# Altium schematic sheet TCA9548A.SchDoc
size B
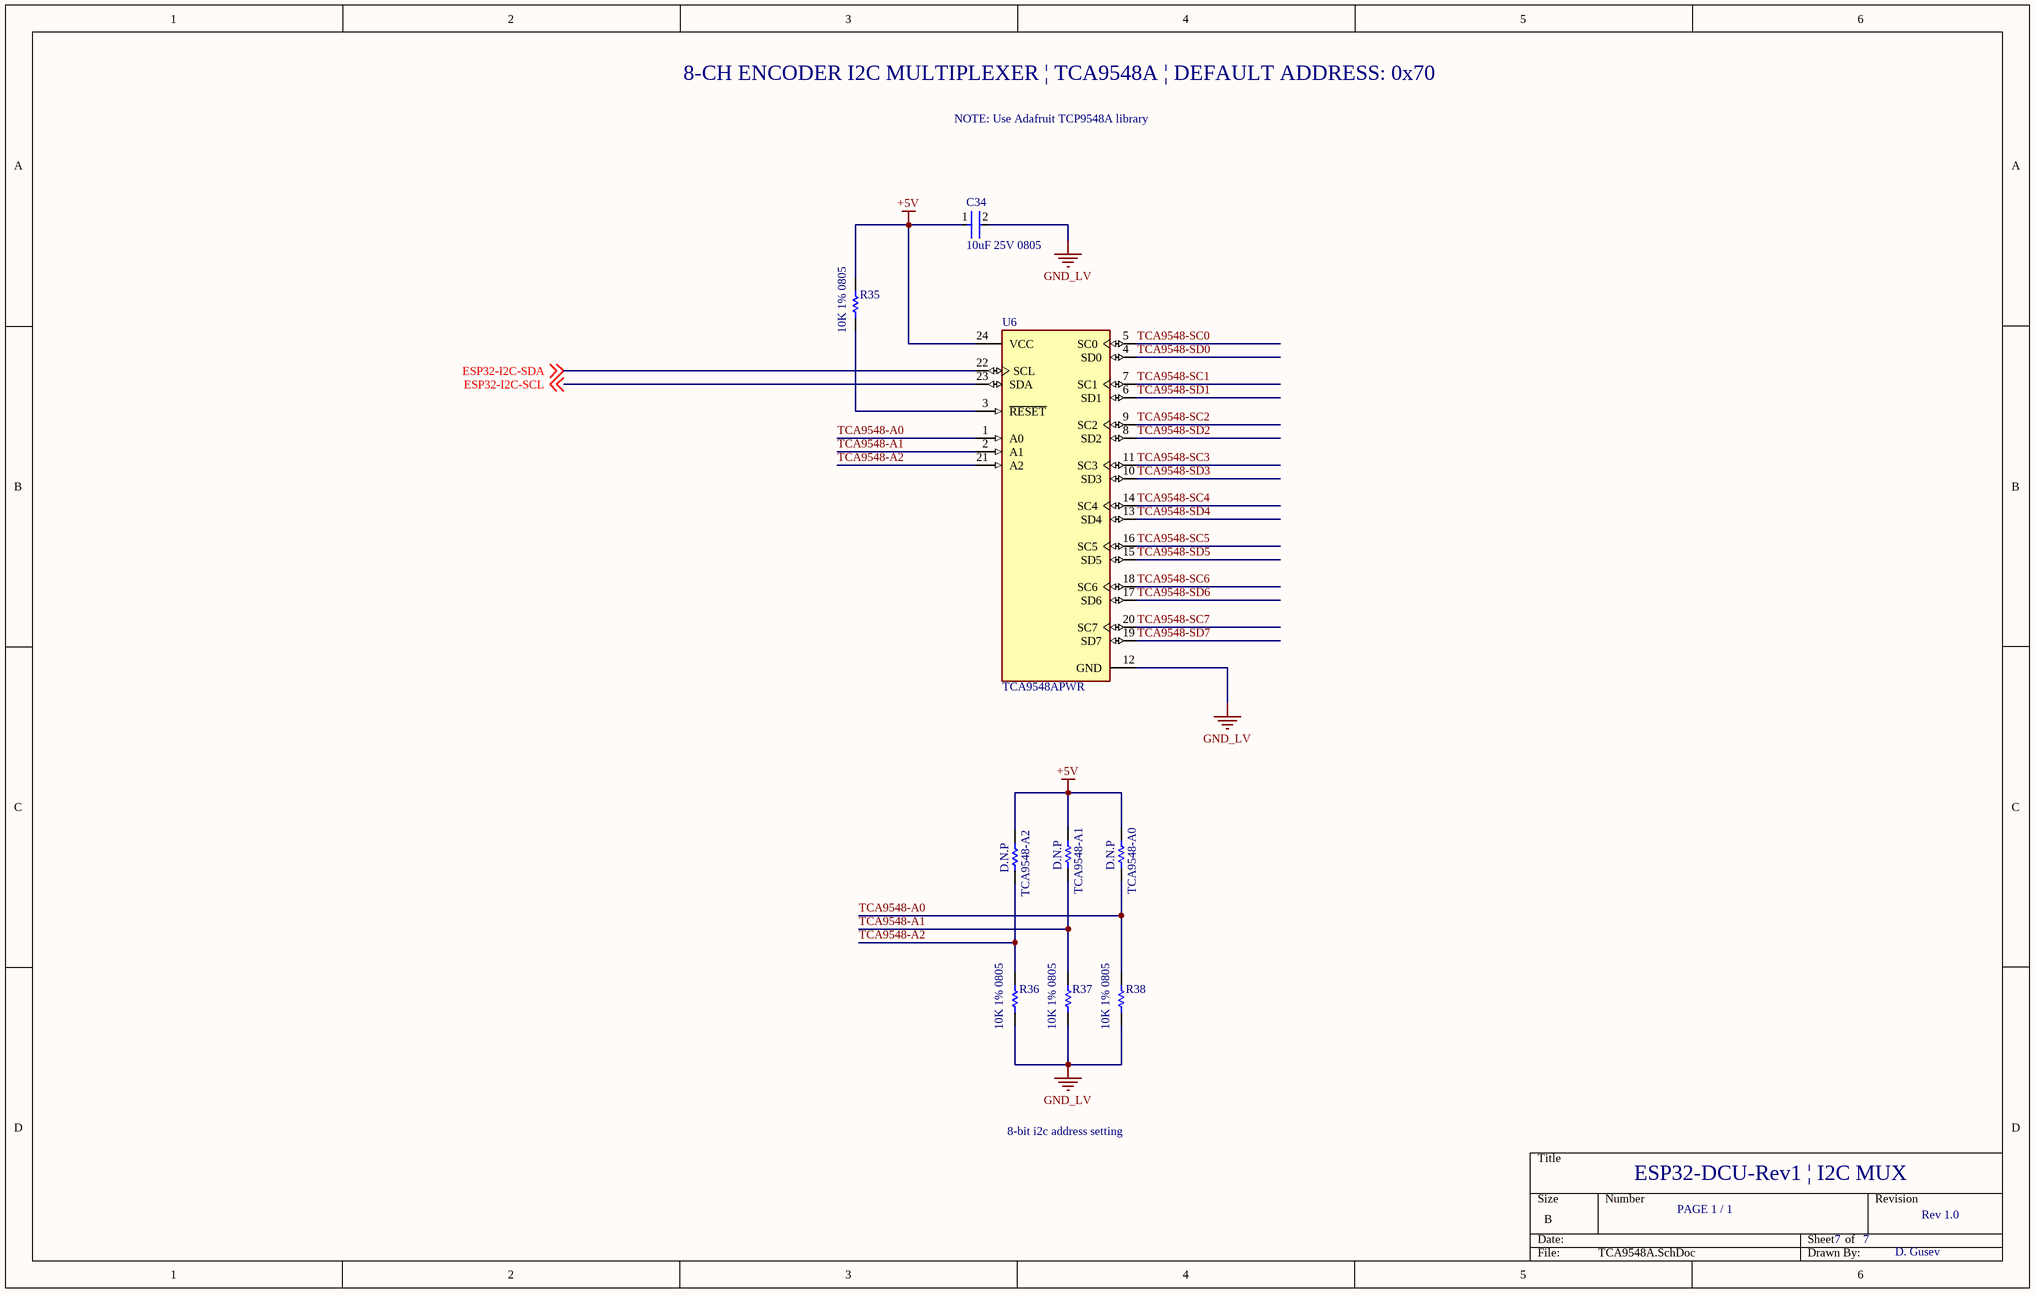
[diagram p0: TCA9548A.SchDoc]

## Parts
C34  10uF 25V 0805  [FP-GRM21B-0_15-IPC_B]
R35  10K 1% 0805  [RESC2013X60X35ML10T20]
R36  10K 1% 0805  [RESC2013X60X35ML10T20]
R37  10K 1% 0805  [RESC2013X60X35ML10T20]
R38  10K 1% 0805  [RESC2013X60X35ML10T20]
TCA9548-A0  D.N.P  [RESC2013X60X35LL10T20]
TCA9548-A1  D.N.P  [RESC2013X60X35LL10T20]
TCA9548-A2  D.N.P  [RESC2013X60X35LL10T20]
U6  TCA9548APWR  [FP-PW0024A-MFG]

## Nets
+5V: C34.1 R35.2 TCA9548-A0.2 TCA9548-A1.2 TCA9548-A2.2 U6.24(VCC)
GND_LV: C34.2 R36.2 R37.2 R38.2 U6.12(GND)
ESP32-I2C-SCL: U6.23(SDA) ; off-sheet ESP32-I2C-SCL
ESP32-I2C-SDA: U6.22(SCL) ; off-sheet ESP32-I2C-SDA
TCA9548-A0: R38.1 TCA9548-A0.1 U6.1(A0)
TCA9548-A1: R37.1 TCA9548-A1.1 U6.2(A1)
TCA9548-A2: R36.1 TCA9548-A2.1 U6.21(A2)
TCA9548-SC0: U6.5(SC0)
TCA9548-SC1: U6.7(SC1)
TCA9548-SC2: U6.9(SC2)
TCA9548-SC3: U6.11(SC3)
TCA9548-SC4: U6.14(SC4)
TCA9548-SC5: U6.16(SC5)
TCA9548-SC6: U6.18(SC6)
TCA9548-SC7: U6.20(SC7)
TCA9548-SD0: U6.4(SD0)
TCA9548-SD1: U6.6(SD1)
TCA9548-SD2: U6.8(SD2)
TCA9548-SD3: U6.10(SD3)
TCA9548-SD4: U6.13(SD4)
TCA9548-SD5: U6.15(SD5)
TCA9548-SD6: U6.17(SD6)
TCA9548-SD7: U6.19(SD7)
NetR35_1: R35.1 U6.3(~{RESET})

## Notes on the sheet
- 8-CH ENCODER I2C MULTIPLEXER | TCA9548A | DEFAULT ADDRESS: 0x70
- NOTE: Use Adafruit TCP9548A library
- 8-bit i2c address setting
- ESP32-DCU-Rev1 | I2C MUX
- PAGE 1 / 1
- 7
- Rev 1.0
- D. Gusev

## Library data of the parts
C34 = CMP-2007-03541-2: Chip Multilayer Ceramic Capacitors for General Purpose, 0805, 10uF, X5R, 15%, 10%, 25V; Length: 2mm; Depth: 1.25mm; Termination: SMD/SMT; Voltage: 25V; Height: 1.25mm; Material: Ceramic; Thickness: 0.053inch; Radiation Hardening: No; Min Operating Temperature: -55°C; Width: 0.049inch; Package Quantity: 1; Mount: Surface Mount; Dielectric: X5R; Packaging: Tape and Reel; Capacitance: 10uF; Voltage Rating (DC): 25V; Lead Free: Lead Free; Max Operating Temperature: 85°C; Case Code (Imperial): 0805; Case/Package: 0805; Tolerance: 10%; Voltage Rating: 25V; Case Code (Metric): 2012
R35-R38 = CMP-2000-05025-1: Chip Resistor, 10 KOhm, +/- 5%, 0.125 W, -55 to 155 degC, 0805 (2012 Metric), RoHS, Tape and Reel; Manufacturer: Yageo; Resistor Element Type: ThickFilm; Voltage Rating: 150V; Product Range: RCSeries; SVHC: ToBeAdvised; Resistor Case Style: 0805[2012Metric]; Temperature Coefficient: ±100ppm/degC; Power Rating: 250mW; Resistance: 10kohm; Automotive Qualification Standard: -; Datasheet Version: REV. 2, 09/2004; Packaging: CutTape; Resistance Tolerance: ±5%; MSL: MSL1-Unlimited; Manufacturer URL: http://www.yageo.com/; Datasheet URL: http://www.yageo.ru/pdf/RC0805.pdf; Package Description: 2-Pin Surface Mounted Device, Body 2 x 1.25 mm; Package Reference: 805
TCA9548-A0-TCA9548-A2 = CMP-1659-00014-4: Chip Resistor, 1 Ohm, +/- 1%, 125 mW, -55 to 155 degC, 0805 (2012 Metric), RoHS, Tape and Reel; Manufacturer: Yageo; Voltage Rating: 150 V; REACH SVHC: No SVHC; Mounting Technology: Surface Mount; RoHSCompliant: true; Packaging: Tape and Reel; ComponentLink2URL: http://www.yageo.com/documents/recent/PYu-RC_Group_51_RoHS_L_04.pdf; Pins: 2; Package Quantity: 5000; DatasheetVersion: Rev. 4, 02/2016; Mount: Surface Mount; Max Operating Temperature: 155 degC; PackageDescription: 2-Pin Surface Mounted Device, Body 2 x 1.25 mm; PackageReference: 0805; Length: 2 mm; Min Operating Temperature: -55 degC; ComponentLink1URL: http://www.yageo.com/; Height: 0.5 mm; ComponentLink1Description: Manufacturer URL; ComponentLink2Description: Datasheet
U6 = CMP-04892-000002-1: IC I2C SW 8CH W/RESET 24TSSOP; Manufacturer: Texas Instruments; Number Of Circuits: 1; Mux Demux Ratio: 1:8; Nominal Supply Current: 2-50uA; Interface: I2C,SMBus; Min Supply Voltage: 1.65V; Standoff Height: 0.05mm; Description: Bus Switch 1 x 8:1 24-TSSOP; Max Supply Voltage: 5.5V; Device Class L2: Interface ICs; ComponentLink2Description: Datasheet; Ipc Land Pattern Name: SOP65P640X120-24; Category: IC; Device Class L1: Integrated Circuits (ICs); Manufacturer Part Number: TCA9548APWR; RoHS: TRUE; Temperature Range High: +85°C; Digikey Description: IC I2C SW 8CH W/RESET 24TSSOP; Temperature Range Low: -40°C; Lead Free: Yes; Package: PW0024A; ComponentLink2URL: http://www.ti.com/lit/ds/symlink/tca9548a.pdf; Device Class L3: Multiplexers; Ambient Temperature Range Low: -40°C; Mouser Description: Low-Voltage 8-Channel I2C Switch With Reset 24-TSSOP -40 to 85; Temperature: -40°C to +85°C; Octopart: https://octopart.com/tca9548apwr-texas+instruments-22266789; Ambient Temperature Range High: +85°C; Automotive: No; Height: 1.2mm